# EasyEDA Pro project Modular-Analog-Synthesizer.eprj, board wavefolder-PCB
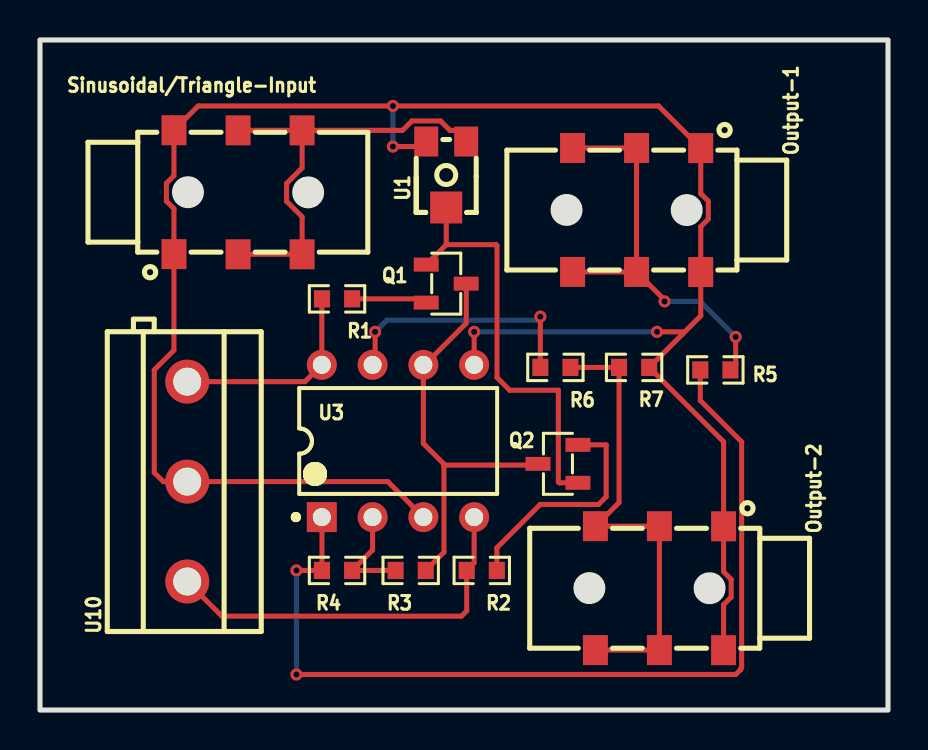
[diagram p13: board, top side]
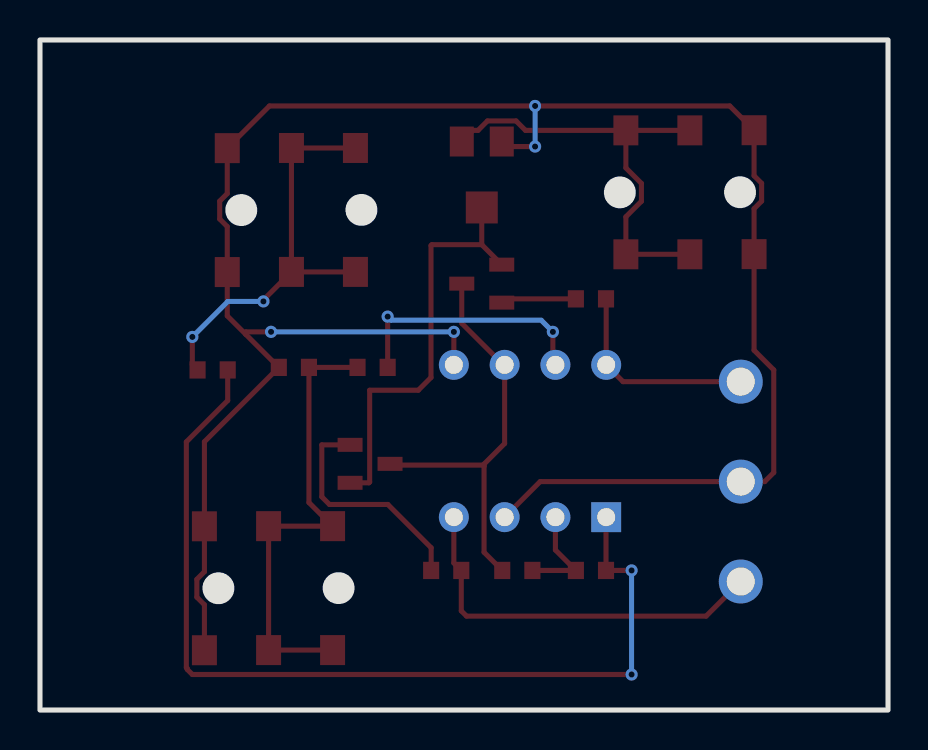
[diagram p14: board, bottom side, seen from below]

Outline 42.42 x 33.53 mm; copper layers: Top Layer, Bottom Layer. Coordinates in mm from the lower left corner of the outline.
Outline path: rectangle 0,33.53 42.42,0
Stack: Top Layer 0.035mm / Dielectric1 1.51mm FR4 er 4.5 / Bottom Layer 0.035mm

## Design rules (mm)
template: JLCPCB Capability(Two Layers Board)
spacing copperThickness1oz (default): track to track 0.102, other pairs 0.152 to 0.3
spacing copperThickness2oz: track to track 0.203, other pairs 0.152 to 0.3
track width copperThickness1oz (default): min 0.127, default 0.254, max 2.54
track width copperThickness2oz: min 0.203, default 0.254, max 2.54
differential pair differentialPair (default): width min 0.127, default 0.254, max 2.54; gap min 0.152, default 0.152
via viaSize (default): diameter min 0.5, default 0.61, max 10; hole min 0.3, default 0.305, max 6.3

## Placement (name value [footprint] x y rotation side)
Output-1  -  [AUDIO-SMD_PJ-313D]  29.84 25.02 270 top
Output-2  -  [AUDIO-SMD_PJ-313D]  30.99 6.1 270 top
Q1  -  [SOT-23-3_L2.9-W1.3-P0.95-LS2.4-BR]  20.32 21.34 180 top
Q2  -  [SOT-23-3_L2.9-W1.3-P1.90-LS2.4-BR]  25.91 12.32 0 top
R1  20k  [R0603]  14.86 20.57 180 top
R2  20k  [R0603]  22.1 6.98 0 top
R3  10K  [R0603]  18.54 6.98 180 top
R4  100K  [R0603]  14.86 6.98 180 top
R5  1K  [R0603]  33.78 17.02 0 top
R6  2.2K  [R0603]  25.78 17.15 0 top
R7  1K  [R0603]  29.72 17.15 180 top
Sinusoidal/Triangle-Input  -  [AUDIO-SMD_PJ-313D]  9.91 25.91 90 top
U1  Pot-100k  [RES-ADJ-SMD_VG039NCH]  20.32 26.8 90 top
U3  TL072  [DIP-8_L9.7-W6.6-P2.54-LS7.6-BL]  17.91 13.46 0 top
U10  -  [CONN-TH_3P-P5.00_KF301-5.0-3P]  7.37 11.43 90 top

## Footprints (pads in the part's own frame, mm; a bottom-side part is the same pattern mirrored in y, then rotated)
AUDIO-SMD_PJ-313D
  rect 1.501x1.25 smd: 1(-3.096,3.205) 1(3.104,3.205) 2(-3.104,-3.205) 2(3.096,-3.205) 3(-3.104,-0.005) 3(3.096,-0.005)
CONN-TH_3P-P5.00_KF301-5.0-3P
  round 2.2 hole 1.399: 1(-4.998,0) 2(0,0) 3(5.002,0)
DIP-8_L9.7-W6.6-P2.54-LS7.6-BL
  rect 1.5x1.5 hole 0.9: 1(-3.81,-3.81)
  round 1.5 hole 0.9: 2(-1.27,-3.81) 3(1.27,-3.81) 4(3.81,-3.81) 5(3.81,3.81) 6(1.27,3.81) 7(-1.27,3.81) 8(-3.81,3.81)
R0603
  rect 0.806x0.864 smd: 1(-0.753,0) 2(0.753,0)
RES-ADJ-SMD_VG039NCH
  rect 1.5x1.2 smd: 1(1.65,-1) 3(1.65,1)
  rect 1.6x1.6 smd: 2(-1.65,0)
SOT-23-3_L2.9-W1.3-P0.95-LS2.4-BR
  rect 1.25x0.7 smd: 1(1,-0.95) 2(1,0.95) 3(-1,0)
SOT-23-3_L2.9-W1.3-P1.90-LS2.4-BR
  rect 1.25x0.7 smd: 1(1,-0.95) 2(1,0.95) 3(-1,0)

## Nets
As in the schematic.

## Via types
v1: diameter 0.61, hole 0.305, Top Layer to Bottom Layer, 10 vias

## Routing (per net, layer and track width the routed paths; a pad name or vN(x,y) marks a point on that pad's centre or on a via; arc(x,y) is an arc through that point)
GND: length 104.3
  Top Layer w0.254: U3.5 v1(21.72,18.92) ; 32.12,18.8 32.12,18.92 v1(30.86,18.92) ; 32.12,18.8 R7.1 34.19,13.42 Output-2.1 34.19,6.92 34.57,6.54 34.57,5.65 34.19,5.27 Output-2.1 ; 32.12,18.8 33.05,19.72 Output-1.1 33.05,24.19 33.43,24.57 33.43,25.46 33.05,25.84 Output-1.1 30.94,30.23 v1(17.65,30.23) 7.91,30.23 Sinusoidal/Triangle-Input.1 6.7,26.74 6.32,26.36 6.32,25.46 6.7,25.09 Sinusoidal/Triangle-Input.1 6.7,18 5.72,17.02 5.72,11.88 6.17,11.43 U10.2 17.4,11.43 U3.3 ; U1.3 19.07,28.19 v1(17.65,28.19)
  Bottom Layer w0.254: v1(21.72,18.92) v1(30.86,18.92) ; v1(17.65,28.19) v1(17.65,30.23)
VCC: length 10.4
  Top Layer w0.254: U10.3 13.26,16.43 U3.8 14.1,20.57 R1.2
VEE: length 19.6
  Top Layer w0.254: U3.4 21.72,7.36 R2.1 21.34,4.96 21.08,4.7 9.1,4.7 U10.1
$1N382: length 21.4
  Top Layer w0.254: Q2.1 25.97,11.37 25.93,11.41 25.93,16 23.5,16 22.86,16.64 22.86,23.24 22.81,23.29 20.32,23.29 ; 20.32,23.29 Q1.1 ; 20.32,23.29 U1.2
$1N386: length 20.8
  Top Layer w0.254: Q2.3 24.63,12.32 24.57,12.26 20.26,12.26 20.21,12.2 ; 20.21,12.2 20.21,12.31 19.18,13.34 U3.6 19.24,17.27 21.32,19.35 Q1.3 ; 20.21,12.2 20.21,7.9 R3.1
$1N418: length 3.8
  Top Layer w0.254: Q1.2 19.13,20.57 R1.1
$1N854: length 47.3
  Top Layer w0.254: R5.1 33.03,15.49 35.1,13.42 35.1,2.13 35.05,2.08 35.05,2.03 34.8,1.78 v1(12.83,1.78) ; U3.1 14.11,9.64 R4.2 v1(12.83,6.98)
  Bottom Layer w0.254: v1(12.83,6.98) v1(12.83,1.78)
$1N860: length 5.3
  Top Layer w0.254: R3.2 R4.1 16.64,8.01 U3.2
$1N1050: length 23.5
  Top Layer w0.254: R6.2 R7.2 28.96,10.38 Output-2.2 Output-2.3 Output-2.3 Output-2.2
$1N1064: length 20.7
  Top Layer w0.254: v1(31.24,20.45) 31.24,20.52 Output-1.3 ; R5.2 34.8,17.28 v1(34.8,18.67) ; Output-1.3 Output-1.3 Output-1.2 ; Output-1.3 Output-1.2
  Bottom Layer w0.254: v1(31.24,20.45) 33.02,20.45 v1(34.8,18.67)
$1N1428: length 11.7
  Top Layer w0.254: Q2.2 28.32,13.27 28.32,10.67 27.94,10.29 25.02,10.29 22.85,8.12 R2.2
$1N1437: length 22.1
  Top Layer w0.254: U1.1 20.76,29 20.51,29 20.04,29.48 18.6,29.48 18.13,29 Sinusoidal/Triangle-Input.2 ; Sinusoidal/Triangle-Input.2 13.11,27.13 12.33,26.35 12.33,25.46 13.11,24.68 Sinusoidal/Triangle-Input.2 Sinusoidal/Triangle-Input.3 ; Sinusoidal/Triangle-Input.2 Sinusoidal/Triangle-Input.3
$1N1598: length 12.8
  Top Layer w0.254: R6.1 v1(25.03,19.69) ; v1(16.76,18.92) 16.76,17.4 U3.7
  Bottom Layer w0.254: v1(16.76,18.92) 17.35,19.51 24.85,19.51 v1(25.03,19.69)
